# Altium schematic sheet [06] - PROCESSOR 3 of 3. EXPANSION.SchDoc
size A2; DocumentNumber: 6; SheetNumber: 6; SheetTotal: 13; NameAuthor: Angle Vu
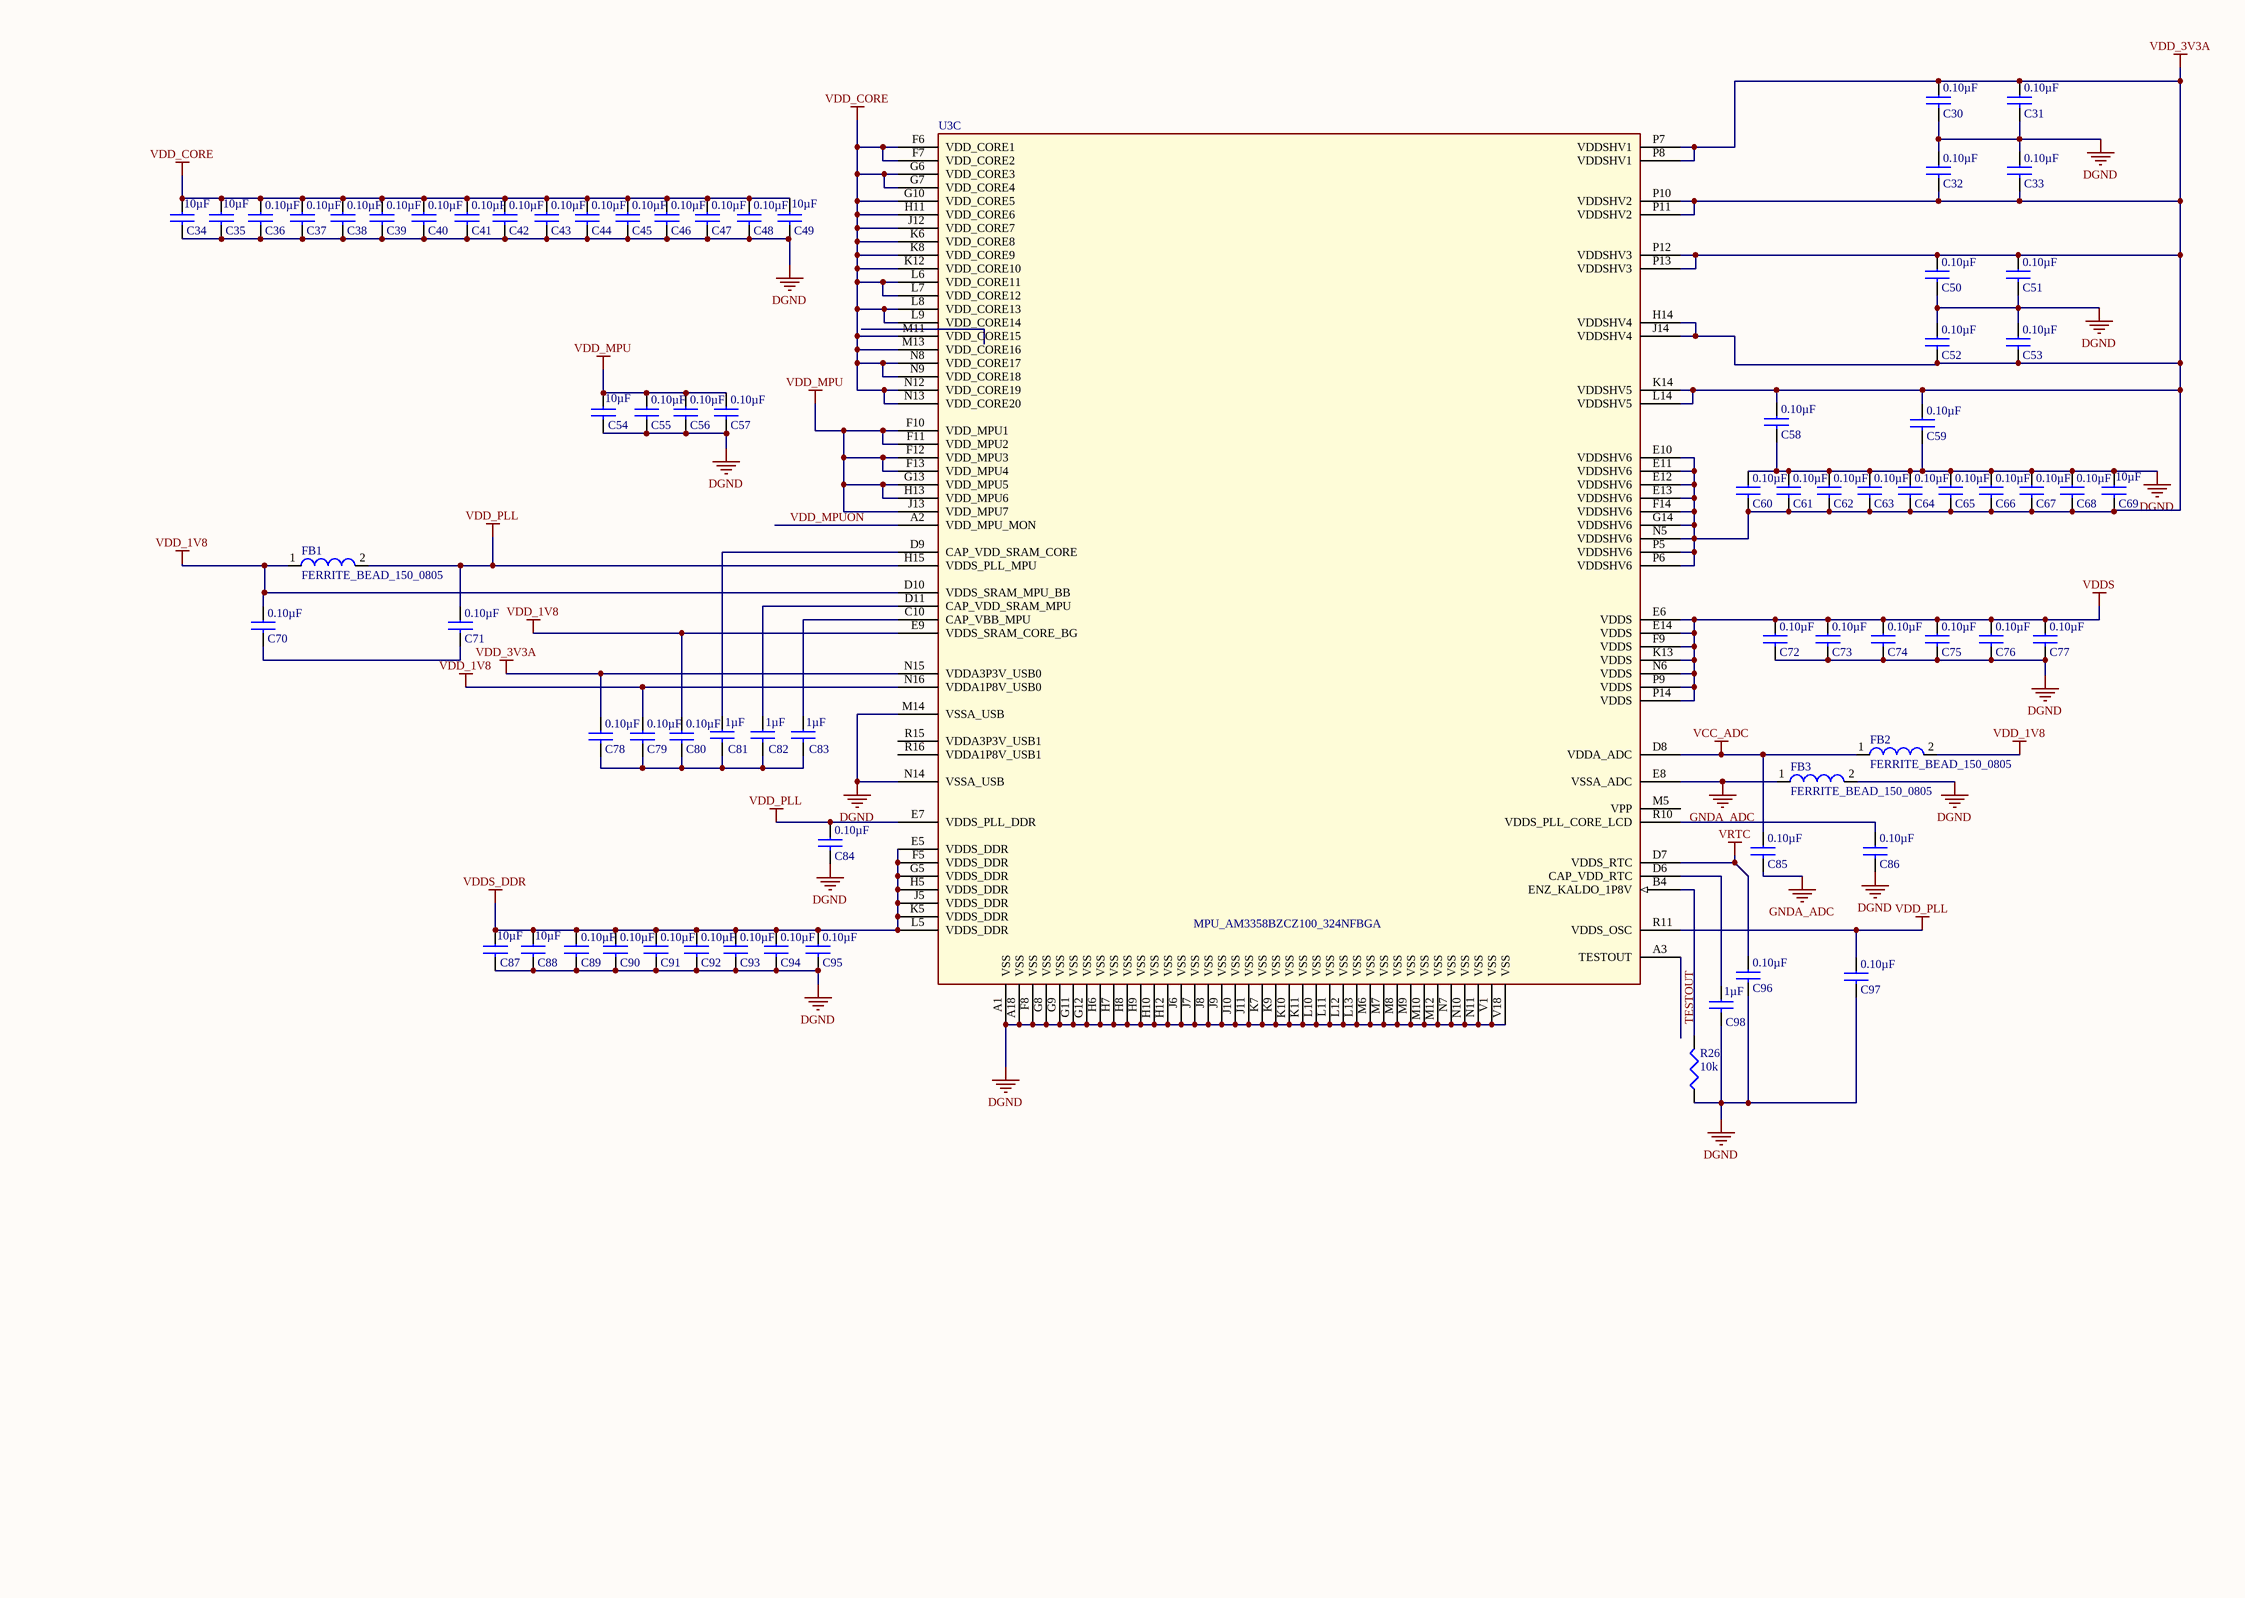
[diagram p0: [06] - PROCESSOR 3 of 3. EXPANSION.SchDoc]

## Parts
C30  Capacitance: 0.10µF  (hidden comment: C_CER_0.1uF_6.3V_X5R_0402_10%)
C31  Capacitance: 0.10µF  (hidden comment: C_CER_0.1uF_6.3V_X5R_0402_10%)
C32  Capacitance: 0.10µF  (hidden comment: C_CER_0.1uF_6.3V_X5R_0402_10%)
C33  Capacitance: 0.10µF  (hidden comment: C_CER_0.1uF_6.3V_X5R_0402_10%)
C34  Capacitance: 10µF  (hidden comment: C_CER_10uF_10V_X7R_0805_10%)
C35  Capacitance: 10µF  (hidden comment: C_CER_10uF_10V_X7R_0805_10%)
C36  Capacitance: 0.10µF  (hidden comment: C_CER_0.1uF_6.3V_X5R_0402_10%)
C37  Capacitance: 0.10µF  (hidden comment: C_CER_0.1uF_6.3V_X5R_0402_10%)
C38  Capacitance: 0.10µF  (hidden comment: C_CER_0.1uF_6.3V_X5R_0402_10%)
C39  Capacitance: 0.10µF  (hidden comment: C_CER_0.1uF_6.3V_X5R_0402_10%)
C40  Capacitance: 0.10µF  (hidden comment: C_CER_0.1uF_6.3V_X5R_0402_10%)
C41  Capacitance: 0.10µF  (hidden comment: C_CER_0.1uF_6.3V_X5R_0402_10%)
C42  Capacitance: 0.10µF  (hidden comment: C_CER_0.1uF_6.3V_X5R_0402_10%)
C43  Capacitance: 0.10µF  (hidden comment: C_CER_0.1uF_6.3V_X5R_0402_10%)
C44  Capacitance: 0.10µF  (hidden comment: C_CER_0.1uF_6.3V_X5R_0402_10%)
C45  Capacitance: 0.10µF  (hidden comment: C_CER_0.1uF_6.3V_X5R_0402_10%)
C46  Capacitance: 0.10µF  (hidden comment: C_CER_0.1uF_6.3V_X5R_0402_10%)
C47  Capacitance: 0.10µF  (hidden comment: C_CER_0.1uF_6.3V_X5R_0402_10%)
C48  Capacitance: 0.10µF  (hidden comment: C_CER_0.1uF_6.3V_X5R_0402_10%)
C49  Capacitance: 10µF  (hidden comment: C_CER_10uF_10V_X7R_0805_10%)
C50  Capacitance: 0.10µF  (hidden comment: C_CER_0.1uF_6.3V_X5R_0402_10%)
C51  Capacitance: 0.10µF  (hidden comment: C_CER_0.1uF_6.3V_X5R_0402_10%)
C52  Capacitance: 0.10µF  (hidden comment: C_CER_0.1uF_6.3V_X5R_0402_10%)
C53  Capacitance: 0.10µF  (hidden comment: C_CER_0.1uF_6.3V_X5R_0402_10%)
C54  Capacitance: 10µF  (hidden comment: C_CER_10uF_10V_X7R_0805_10%)
C55  Capacitance: 0.10µF  (hidden comment: C_CER_0.1uF_6.3V_X5R_0402_10%)
C56  Capacitance: 0.10µF  (hidden comment: C_CER_0.1uF_6.3V_X5R_0402_10%)
C57  Capacitance: 0.10µF  (hidden comment: C_CER_0.1uF_6.3V_X5R_0402_10%)
C58  Capacitance: 0.10µF  (hidden comment: C_CER_0.1uF_6.3V_X5R_0402_10%)
C59  Capacitance: 0.10µF  (hidden comment: C_CER_0.1uF_6.3V_X5R_0402_10%)
C60  Capacitance: 0.10µF  (hidden comment: C_CER_0.1uF_6.3V_X5R_0402_10%)
C61  Capacitance: 0.10µF  (hidden comment: C_CER_0.1uF_6.3V_X5R_0402_10%)
C62  Capacitance: 0.10µF  (hidden comment: C_CER_0.1uF_6.3V_X5R_0402_10%)
C63  Capacitance: 0.10µF  (hidden comment: C_CER_0.1uF_6.3V_X5R_0402_10%)
C64  Capacitance: 0.10µF  (hidden comment: C_CER_0.1uF_6.3V_X5R_0402_10%)
C65  Capacitance: 0.10µF  (hidden comment: C_CER_0.1uF_6.3V_X5R_0402_10%)
C66  Capacitance: 0.10µF  (hidden comment: C_CER_0.1uF_6.3V_X5R_0402_10%)
C67  Capacitance: 0.10µF  (hidden comment: C_CER_0.1uF_6.3V_X5R_0402_10%)
C68  Capacitance: 0.10µF  (hidden comment: C_CER_0.1uF_6.3V_X5R_0402_10%)
C69  Capacitance: 10µF  (hidden comment: C_CER_10uF_10V_X7R_0805_10%)
C70  Capacitance: 0.10µF  (hidden comment: C_CER_0.1uF_6.3V_X5R_0402_10%)
C71  Capacitance: 0.10µF  (hidden comment: C_CER_0.1uF_6.3V_X5R_0402_10%)
C72  Capacitance: 0.10µF  (hidden comment: C_CER_0.1uF_6.3V_X5R_0402_10%)
C73  Capacitance: 0.10µF  (hidden comment: C_CER_0.1uF_6.3V_X5R_0402_10%)
C74  Capacitance: 0.10µF  (hidden comment: C_CER_0.1uF_6.3V_X5R_0402_10%)
C75  Capacitance: 0.10µF  (hidden comment: C_CER_0.1uF_6.3V_X5R_0402_10%)
C76  Capacitance: 0.10µF  (hidden comment: C_CER_0.1uF_6.3V_X5R_0402_10%)
C77  Capacitance: 0.10µF  (hidden comment: C_CER_0.1uF_6.3V_X5R_0402_10%)
C78  Capacitance: 0.10µF  (hidden comment: C_CER_0.1uF_6.3V_X5R_0402_10%)
C79  Capacitance: 0.10µF  (hidden comment: C_CER_0.1uF_6.3V_X5R_0402_10%)
C80  Capacitance: 0.10µF  (hidden comment: C_CER_0.1uF_6.3V_X5R_0402_10%)
C81  Capacitance: 1µF  (hidden comment: C_CER_1uF_6.3V_X5R_0402_10%)
C82  Capacitance: 1µF  (hidden comment: C_CER_1uF_6.3V_X5R_0402_10%)
C83  Capacitance: 1µF  (hidden comment: C_CER_1uF_6.3V_X5R_0402_10%)
C84  Capacitance: 0.10µF  (hidden comment: C_CER_0.1uF_6.3V_X5R_0402_10%)
C85  Capacitance: 0.10µF  (hidden comment: C_CER_0.1uF_6.3V_X5R_0402_10%)
C86  Capacitance: 0.10µF  (hidden comment: C_CER_0.1uF_6.3V_X5R_0402_10%)
C87  Capacitance: 10µF  (hidden comment: C_CER_10uF_10V_X7R_0805_10%)
C88  Capacitance: 10µF  (hidden comment: C_CER_10uF_10V_X7R_0805_10%)
C89  Capacitance: 0.10µF  (hidden comment: C_CER_0.1uF_6.3V_X5R_0402_10%)
C90  Capacitance: 0.10µF  (hidden comment: C_CER_0.1uF_6.3V_X5R_0402_10%)
C91  Capacitance: 0.10µF  (hidden comment: C_CER_0.1uF_6.3V_X5R_0402_10%)
C92  Capacitance: 0.10µF  (hidden comment: C_CER_0.1uF_6.3V_X5R_0402_10%)
C93  Capacitance: 0.10µF  (hidden comment: C_CER_0.1uF_6.3V_X5R_0402_10%)
C94  Capacitance: 0.10µF  (hidden comment: C_CER_0.1uF_6.3V_X5R_0402_10%)
C95  Capacitance: 0.10µF  (hidden comment: C_CER_0.1uF_6.3V_X5R_0402_10%)
C96  Capacitance: 0.10µF  (hidden comment: C_CER_0.1uF_6.3V_X5R_0402_10%)
C97  Capacitance: 0.10µF  (hidden comment: C_CER_0.1uF_6.3V_X5R_0402_10%)
C98  Capacitance: 1µF  (hidden comment: C_CER_1uF_6.3V_X5R_0402_10%)
FB1  FERRITE_BEAD_150_0805
FB2  FERRITE_BEAD_150_0805
FB3  FERRITE_BEAD_150_0805
R26  Resistance (Ohms): 10k  (hidden comment: R_10K_1/16W_0402_1%)
U3  MPU_AM3358BZCZ100_324NFBGA  (part C of 3)

## Nets
DGND: C30.2 C31.2 C32.1 C33.1 C34.2 C35.2 C36.2 C37.2 C38.2 C39.2 C40.2 C41.2 C42.2 C43.2 C44.2 C45.2 C46.2 C47.2 C48.2 C49.2 C50.2 C51.2 C52.1 C53.1 C54.2 C55.2 C56.2 C57.2 C58.2 C59.2 C60.1 C61.1 C62.1 C63.1 C64.1 C65.1 C66.1 C67.1 C68.1 C69.1 C72.2 C73.2 C74.2 C75.2 C76.2 C77.2 C84.2 C86.2 C87.2 C88.2 C89.2 C90.2 C91.2 C92.2 C93.2 C94.2 C95.2 C96.2 C97.2 C98.2 FB3.2 R26.1 U3.A1(VSS) U3.A18(VSS) U3.F8(VSS) U3.G8(VSS) U3.G9(VSS) U3.G11(VSS) U3.G12(VSS) U3.H6(VSS) U3.H7(VSS) U3.H8(VSS) U3.H9(VSS) U3.H10(VSS) U3.H12(VSS) U3.J6(VSS) U3.J7(VSS) U3.J8(VSS) U3.J9(VSS) U3.J10(VSS) U3.J11(VSS) U3.K7(VSS) U3.K9(VSS) U3.K10(VSS) U3.K11(VSS) U3.L10(VSS) U3.L11(VSS) U3.L12(VSS) U3.L13(VSS) U3.M6(VSS) U3.M7(VSS) U3.M8(VSS) U3.M9(VSS) U3.M10(VSS) U3.M12(VSS) U3.M14(VSSA_USB) U3.N7(VSS) U3.N10(VSS) U3.N11(VSS) U3.N14(VSSA_USB) U3.V1(VSS) U3.V18(VSS)
GNDA_ADC: C85.2 FB3.1 U3.E8(VSSA_ADC)
VCC_ADC: C85.1 FB2.1 U3.D8(VDDA_ADC)
VDD_1V8: C70.1 C79.1 C80.1 FB1.1 FB2.2 U3.D10(VDDS_SRAM_MPU_BB) U3.E9(VDDS_SRAM_CORE_BG) U3.N16(VDDA1P8V_USB0)
VDD_3V3A: C30.1 C31.1 C32.2 C33.2 C50.1 C51.1 C52.2 C53.2 C58.1 C59.1 C60.2 C61.2 C62.2 C63.2 C64.2 C65.2 C66.2 C67.2 C68.2 C69.2 C78.1 U3.E10(VDDSHV6) U3.E11(VDDSHV6) U3.E12(VDDSHV6) U3.E13(VDDSHV6) U3.F14(VDDSHV6) U3.G14(VDDSHV6) U3.H14(VDDSHV4) U3.J14(VDDSHV4) U3.K14(VDDSHV5) U3.L14(VDDSHV5) U3.N5(VDDSHV6) U3.N15(VDDA3P3V_USB0) U3.P5(VDDSHV6) U3.P6(VDDSHV6) U3.P7(VDDSHV1) U3.P8(VDDSHV1) U3.P10(VDDSHV2) U3.P11(VDDSHV2) U3.P12(VDDSHV3) U3.P13(VDDSHV3)
VDD_CORE: C34.1 C35.1 C36.1 C37.1 C38.1 C39.1 C40.1 C41.1 C42.1 C43.1 C44.1 C45.1 C46.1 C47.1 C48.1 C49.1 U3.F6(VDD_CORE1) U3.F7(VDD_CORE2) U3.G6(VDD_CORE3) U3.G7(VDD_CORE4) U3.G10(VDD_CORE5) U3.H11(VDD_CORE6) U3.J12(VDD_CORE7) U3.K6(VDD_CORE8) U3.K8(VDD_CORE9) U3.K12(VDD_CORE10) U3.L6(VDD_CORE11) U3.L7(VDD_CORE12) U3.L8(VDD_CORE13) U3.L9(VDD_CORE14) U3.M11(VDD_CORE15) U3.M13(VDD_CORE16) U3.N8(VDD_CORE17) U3.N9(VDD_CORE18) U3.N12(VDD_CORE19) U3.N13(VDD_CORE20)
VDD_MPU: C54.1 C55.1 C56.1 C57.1 U3.F10(VDD_MPU1) U3.F11(VDD_MPU2) U3.F12(VDD_MPU3) U3.F13(VDD_MPU4) U3.G13(VDD_MPU5) U3.H13(VDD_MPU6) U3.J13(VDD_MPU7)
VDD_PLL: C71.1 C84.1 C97.1 FB1.2 U3.E7(VDDS_PLL_DDR) U3.H15(VDDS_PLL_MPU) U3.R11(VDDS_OSC)
VDDS: C72.1 C73.1 C74.1 C75.1 C76.1 C77.1 U3.E6(VDDS) U3.E14(VDDS) U3.F9(VDDS) U3.K13(VDDS) U3.N6(VDDS) U3.P9(VDDS) U3.P14(VDDS)
VDDS_DDR: C87.1 C88.1 C89.1 C90.1 C91.1 C92.1 C93.1 C94.1 C95.1 U3.E5(VDDS_DDR) U3.F5(VDDS_DDR) U3.G5(VDDS_DDR) U3.H5(VDDS_DDR) U3.J5(VDDS_DDR) U3.K5(VDDS_DDR) U3.L5(VDDS_DDR)
VRTC: C96.1 U3.D7(VDDS_RTC)
TESTOUT: U3.A3(TESTOUT)
VDD_MPUON: U3.A2(VDD_MPU_MON)
NetC70_2: C70.2 C71.2
NetC78_2: C78.2 C79.2 C80.2 C81.2 C82.2 C83.2
NetC81_1: C81.1 U3.D9(CAP_VDD_SRAM_CORE)
NetC82_1: C82.1 U3.D11(CAP_VDD_SRAM_MPU)
NetC83_1: C83.1 U3.C10(CAP_VBB_MPU)
NetC86_1: C86.1 U3.R10(VDDS_PLL_CORE_LCD)
NetC98_1: C98.1 U3.D6(CAP_VDD_RTC)
NetR26_2: R26.2 U3.B4(ENZ_KALDO_1P8V)

Not connected (* = marked no-connect by the designer): U3 M5(VPP) R15(VDDA3P3V_USB1) R16(VDDA1P8V_USB1)

## Notes on the sheet
- CLOCKS (CPU & PCIE)
- Designed By
- Checked By
- Page Name:
- Size:
- A2
- Company:
- Address:
- Sheet:
- /

## Library data of the parts
C30-C33 C36-C48 C50-C53 C55-C68 C70-C80 C84-C86 C89-C97 = C_CER_0.1uF_6.3V_X5R_0402_10%: CAP CER 0.1UF 6.3V X5R 0402; Manufacturer: Murata Electronics North America; Manufacturer Part Number: GRM155R60J104KA01D; Tolerance: ±10%; Supplier 1: Digi-Key; RoHS: RoHS Compliant; Category: Capacitors; Stock 1: 370000; Pricing 1: 10000=0.0021, 20000=0.002, 30000=0.0019, 50000=0.0017, 100000=0.00138 (USD); Packaging: Tape & Reel (TR); Part Status: Active; Voltage - Rated: 6.3V; Temperature Coefficient: X5R; Operating Temperature: -55°C ~ 85°C; Features: -; Ratings: -; Applications: General Purpose; Failure Rate: *; Mounting Type: Surface Mount, MLCC; Package / Case: 0402 (1005 Metric); Size / Dimension: 0.039" L x 0.020" W (1.00mm x 0.50mm); Height - Seated (Max): -; Thickness (Max): 0.022" (0.55mm); Lead Spacing: -; Lead Style: -; ComponentLink1URL: http://www.murata.com/~/media/webrenewal/support/library/catalog/products/capacitor/mlcc/c02e.pdf; ComponentLink1Description: http://www.murata.com/~/media/webrenewal/support/library/catalog/products/capacitor/mlcc/c02e.pdf; Supplier Part Number 1: 490-6287-2-ND
C34 C35 C49 C54 C69 C87 C88 = C_CER_10uF_10V_X7R_0805_10%: CAP CER 10UF 10V X7R 0805; Manufacturer: Murata Electronics North America; Manufacturer Part Number: GRM21BR71A106KE51L; Tolerance: ±10%; Supplier 1: Digi-Key; RoHS: RoHS Compliant; Category: Capacitors; Stock 1: 966000; Pricing 1: 3000=0.05, 6000=0.04625, 9000=0.04375, 15000=0.0415, 30000=0.04, 75000=0.0375, 150000=0.03313 (USD); Packaging: Tape & Reel (TR); Part Status: Active; Voltage - Rated: 10V; Temperature Coefficient: X7R; Operating Temperature: -55°C ~ 125°C; Features: -; Ratings: -; Applications: General Purpose; Failure Rate: *; Mounting Type: Surface Mount, MLCC; Package / Case: 0805 (2012 Metric); Size / Dimension: 0.079" L x 0.049" W (2.00mm x 1.25mm); Height - Seated (Max): -; Thickness (Max): 0.053" (1.35mm); Lead Spacing: -; Lead Style: -; ComponentLink1URL: http://www.murata.com/~/media/webrenewal/support/library/catalog/products/capacitor/mlcc/c02e.pdf; ComponentLink1Description: http://www.murata.com/~/media/webrenewal/support/library/catalog/products/capacitor/mlcc/c02e.pdf; Supplier Part Number 1: 490-3905-2-ND
C81-C83 C98 = C_CER_1uF_6.3V_X5R_0402_10%: CAP CER 1UF 6.3V X5R 0402; Manufacturer: Murata Electronics North America; Manufacturer Part Number: GRM155R60J105KE19D; Tolerance: ±10%; Supplier 1: Digi-Key; RoHS: RoHS Compliant; Category: Capacitors; Stock 1: 3360000; Pricing 1: 10000=0.00365, 20000=0.00348, 30000=0.00331, 50000=0.00296, 100000=0.00239 (USD); Packaging: Tape & Reel (TR); Part Status: Active; Voltage - Rated: 6.3V; Temperature Coefficient: X5R; Operating Temperature: -55°C ~ 85°C; Features: -; Ratings: -; Applications: General Purpose; Failure Rate: *; Mounting Type: Surface Mount, MLCC; Package / Case: 0402 (1005 Metric); Size / Dimension: 0.039" L x 0.020" W (1.00mm x 0.50mm); Height - Seated (Max): -; Thickness (Max): 0.022" (0.55mm); Lead Spacing: -; Lead Style: -; ComponentLink1URL: http://www.murata.com/~/media/webrenewal/support/library/catalog/products/capacitor/mlcc/c02e.pdf; ComponentLink1Description: http://www.murata.com/~/media/webrenewal/support/library/catalog/products/capacitor/mlcc/c02e.pdf; Supplier Part Number 1: 490-1320-2-ND
FB1-FB3 = FERRITE_BEAD_150_0805: FERRITE BEAD 150 OHM 0805 1LN; Manufacturer: Murata Electronics North America; Manufacturer Part Number: BLM21AG151SN1D; Number of Lines: 1; Impedance @ Frequency: 150 Ohm @ 100MHz; Current Rating (Max): 800mA; DC Resistance (DCR) (Max): 100 mOhm; Supplier 1: Digi-Key; RoHS: RoHS Compliant; Category: Filters; Stock 1: 24000; Pricing 1: 4000=0.01824, 8000=0.01653, 12000=0.01596, 28000=0.01482, 100000=0.01465 (USD); Packaging: Tape & Reel (TR); Part Status: Active; Filter Type: -; Ratings: -; Operating Temperature: -55°C ~ 125°C; Package / Case: 0805 (2012 Metric); Mounting Type: Surface Mount; Height (Max): 0.041" (1.05mm); Size / Dimension: 0.079" L x 0.049" W (2.00mm x 1.25mm); ComponentLink1URL: http://search.murata.co.jp/Ceramy/image/img/PDF/ENG/L0110S0100BLM21A.pdf; ComponentLink1Description: http://search.murata.co.jp/Ceramy/image/img/PDF/ENG/L0110S0100BLM21A.pdf; Supplier Part Number 1: 490-9703-2-ND
R26 = R_10K_1/16W_0402_1%: RES SMD 10K OHM 1% 1/16W 0402; Manufacturer: Yageo; Manufacturer Part Number: RC0402FR-0710KL; Power (Watts): 0.063W, 1/16W; Temperature Coefficient: ±100ppm/°C; Supplier 1: Digi-Key; RoHS: RoHS Compliant; Category: Resistors; Stock 1: 13060454; Pricing 1: 1=0.1, 10=0.013, 25=0.0096, 100=0.0054, 250=0.00412, 500=0.00328, 1000=0.00242, 2500=0.0021, 5000=0.00173 (USD); Packaging: Cut Tape (CT); Part Status: Active; Tolerance: ±1%; Composition: Thick Film; Features: Moisture Resistant; Operating Temperature: -55°C ~ 155°C; Package / Case: 0402 (1005 Metric); Supplier Device Package: 0402; Size / Dimension: 0.039" L x 0.020" W (1.00mm x 0.50mm); Height: 0.016" (0.40mm); Number of Terminations: 2; Failure Rate: -; ComponentLink1URL: http://www.yageo.com/documents/recent/PYu-RC_Group_51_RoHS_L_04.pdf; ComponentLink1Description: http://www.yageo.com/documents/recent/PYu-RC_Group_51_RoHS_L_04.pdf; Supplier Part Number 1: 311-10.0KLRCT-ND
U3 = MPU_AM3358BZCZ100_324NFBGA: IC MPU SITARA 1.0GHZ 324NFBGA; Manufacturer: Texas Instruments; Core Processor: ARM® Cortex®-A8; Number of Cores/Bus Width: 1 Core, 32-Bit; Co-Processors/DSP: Multimedia; NEON™ SIMD; RAM Controllers: LPDDR, DDR2, DDR3, DDR3L; Graphics Acceleration: Yes; Display & Interface Controllers: LCD, Touchscreen; Ethernet: 10/100/1000 Mbps (2); USB: USB 2.0 + PHY (2); Voltage - I/O: 1.8V, 3.3V; Security Features: Cryptography, Random Number Generator; Additional Interfaces: CAN, I²C, McASP, McSPI, MMC/SD/SDIO, UART; Supplier 1: Digi-Key; Manufacturer Part Number: AM3358BZCZ100; RoHS: RoHS Compliant; Category: Integrated Circuits (ICs); Stock 1: 6211; Pricing 1: 1=19.56, 10=17.978, 100=15.1835, 500=13.50676, 1000=12.38895, 2500=11.9232, 5000=11.64375 (USD); Packaging: Tube; Part Status: Active; Speed: 1.0GHz; SATA: -; Operating Temperature: 0°C ~ 90°C (TJ); Package / Case: 324-LFBGA; Supplier Device Package: 324-NFBGA(15x15); ComponentLink1URL: http://www.ti.com/lit/ds/symlink/am3352.pdf; ComponentLink1Description: http://www.ti.com/lit/ds/symlink/am3352.pdf; Supplier Part Number 1: 296-35869-5-ND